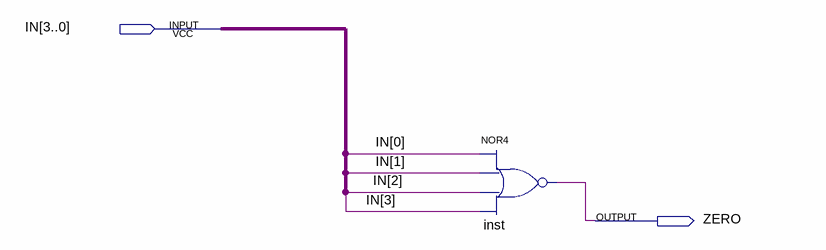
[diagram p0: schematic sheet]
// Quartus schematic check_zero_4_bits.bdf as structural Verilog: 1 symbols, 2 pins
module check_zero_4_bits (
  input  [3:0] IN,
  output ZERO
);

  nor inst (ZERO, IN[0], IN[1], IN[2], IN[3]);
endmodule
